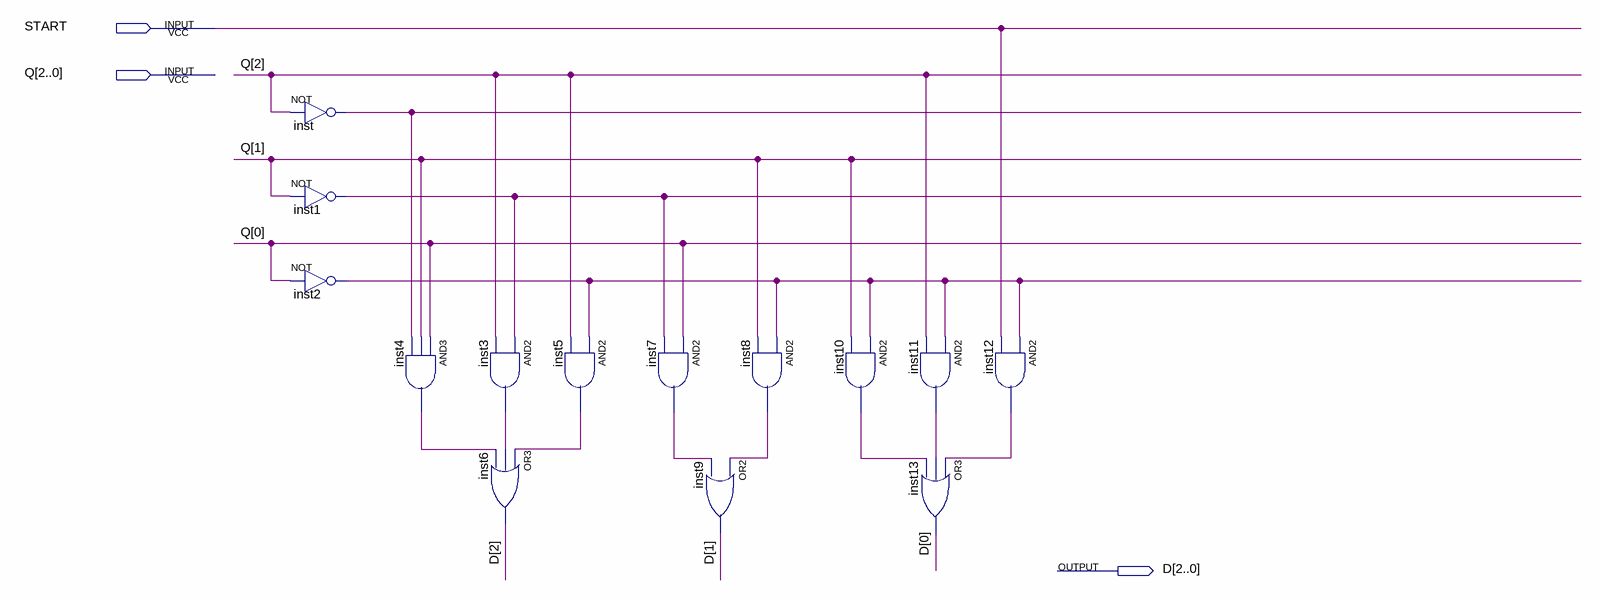
[diagram p0: schematic sheet]
// Quartus schematic NEXT_STATE_SR.bdf as structural Verilog: 14 symbols, 3 pins
module NEXT_STATE_SR (
  input  START,
  input  [2:0] Q,
  output [2:0] D
);

  wire inst1_out, inst2_out, inst3_out, inst4_out, inst5_out, inst7_out, inst8_out, inst10_out, inst11_out,
       inst12_out, inst_out;

  not inst (inst_out, Q[2]);
  not inst1 (inst1_out, Q[1]);
  not inst2 (inst2_out, Q[0]);
  and inst4 (inst4_out, Q[0], Q[1], inst_out);
  and inst3 (inst3_out, inst1_out, Q[2]);
  or inst6 (D[2], inst5_out, inst3_out, inst4_out);
  and inst5 (inst5_out, inst2_out, Q[2]);
  and inst7 (inst7_out, Q[0], inst1_out);
  and inst8 (inst8_out, inst2_out, Q[1]);
  or inst9 (D[1], inst8_out, inst7_out);
  and inst10 (inst10_out, inst2_out, Q[1]);
  and inst11 (inst11_out, inst2_out, Q[2]);
  or inst13 (D[0], inst12_out, inst11_out, inst10_out);
  and inst12 (inst12_out, inst2_out, START);
endmodule
